# Altium schematic sheet PWR2.SchDoc: Power2
size A; Revision: 04
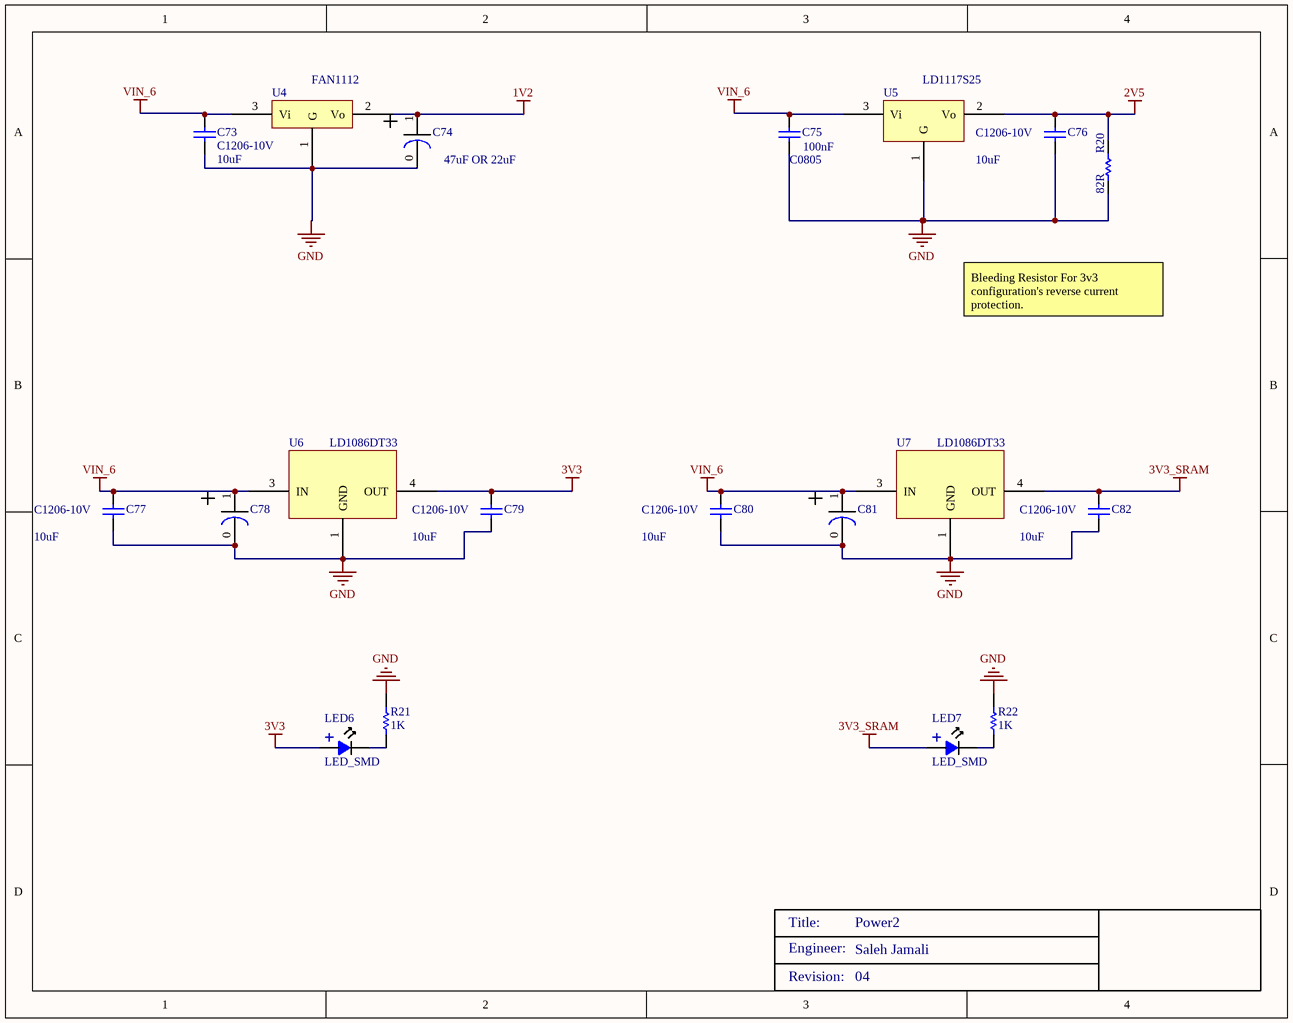
[diagram p0: PWR2.SchDoc]

## Parts
C73  C1206-10V  value 10uF  [1206]
C74  47uF OR 22uF  [22_47u_10A]
C75  C0805  value 100nF  [0805]
C76  C1206-10V  value 10uF  [1206]
C77  C1206-10V  value 10uF  [1206]
C78  Electrolytic SMD Cap  [22_47u_10A]  (value not drawn)
C79  C1206-10V  value 10uF  [1206]
C80  C1206-10V  value 10uF  [1206]
C81  Electrolytic SMD Cap  [22_47u_10A]  (value not drawn)
C82  C1206-10V  value 10uF  [1206]
LED6  LED_SMD  [LED_805]
LED7  LED_SMD  [LED_805]
R20  82R  [ERA-0805]
R21  1K  [ERA-0805]
R22  1K  [ERA-0805]
U4  FAN1112  [DPAK_TO252]
U5  LD1117S25  [SOT223]
U6  LD1086DT33  [LD1086DT33]
U7  LD1086DT33  [LD1086DT33]

## Nets
1V2: C74.1 U4.2(Vo)
2V5: C76.1 R20.2 U5.2(Vo)
3V3: C79.1 LED6.1 U6.4(OUT)
3V3_SRAM: C82.1 LED7.1 U7.4(OUT)
GND: C73.2 C74.0 C75.2 C76.2 C77.2 C78.0 C79.2 C80.2 C81.0 C82.2 R20.1 R21.1 R22.1 U4.1(G) U5.1(G) U6.1(GND) U7.1(GND)
VIN_6: C73.1 C75.1 C77.1 C78.1 C80.1 C81.1 U4.3(Vi) U5.3(Vi) U6.3(IN) U7.3(IN)
NetLED6_2: LED6.2 R21.2
NetLED7_2: LED7.2 R22.2

## Notes on the sheet
- Bleeding Resistor For 3v3 configuration's reverse current protection.
- Engineer:
- Title:
- Saleh Jamali
- Revision:

## Library data of the parts
C73 C76 C77 C79 C80 C82 = C1206: Ceramic Chip Capacitor - Standard; Published: 17-Jul-2002; LatestRevisionDate: 19-Mar-2004; LatestRevisionNote: Silkscreen size reduced.; DatasheetDocument: Mar-2001; PackageDocument: Mar-2001; PackageReference: 1206; Publisher: Altium Limited; Code_JEITA: 1206; Code_IPC: 3216 [1206]; ComponentLink1Description: Manufacturer Link; ComponentLink1URL: http://www.kemet.com/; ComponentLink2Description: Datasheet; ComponentLink2URL: http://www.kemet.com/kemet/web/homepage/kechome.nsf/vapubfilesname/F3102TA.pdf/$file/F3102TA.pdf
C74 = Electrolytic SMD Cap: supplier: eshop.eca.ir
C75 = C0805: Ceramic Chip Capacitor - Standard; Note: Footprint corresponds to dimensions for bulk cassette packaging. This case size has tightened tolerances.; Published: 17-Jul-2002; LatestRevisionDate: 19-Mar-2004; LatestRevisionNote: Silkscreen size reduced.; DatasheetDocument: Mar-2001; PackageDocument: Mar-2001; PackageReference: 0805; Publisher: Altium Limited; Code_JEITA: 0805; Code_IPC: 2012[0805]; ComponentLink1Description: Manufacturer Link; ComponentLink1URL: http://www.kemet.com/; ComponentLink2Description: Datasheet; ComponentLink2URL: http://www.kemet.com/kemet/web/homepage/kechome.nsf/vapubfilesname/F3102TA.pdf/$file/F3102TA.pdf
R20-R22 = ERA6Y: Rectangular Thick Film Chip Resistor, 10 Ohm to 1M Ohm Range, 0.1% and 0.5% Tolerance, 0805 Size, 0.1 W; Note: If flow soldering, adjust pad width of PCB Footprint to 0.7 - 0.8 times the width of the resistor.; Published: 17-Dec-2003; LatestRevisionDate: 19-Mar-2004; LatestRevisionNote: Silkscreen size reduced.; PackageDocument: Mar-2003; PackageReference: ERA-0805; Publisher: Altium Limited; Code_IPC: 2012 [0805]; ComponentLink1Description: Manufacturer Link; ComponentLink1URL: http://www.panasonic.com/industrial/components/resistive_products.htm; ComponentLink2Description: Datasheet; ComponentLink2URL: http://www.panasonic.com/industrial/components/pdf/AOA0000CE8.pdf
U4 = FAN1112_1.2V_REGULATER: 1.2 volt regulator
U5 = LD1117S25: 2.5 volt, 800mA Regulator
U6 U7 = LD1086DT33: LOW DROP FIXED AND ADJUSTABLE  POSITIVE VOLTAGE REGULATORS
C78 C81 = Electrolytic SMD Cap: supplier: eshop.eca.ir